# EAGLE schematic umro (EAGLE 6.5.0)
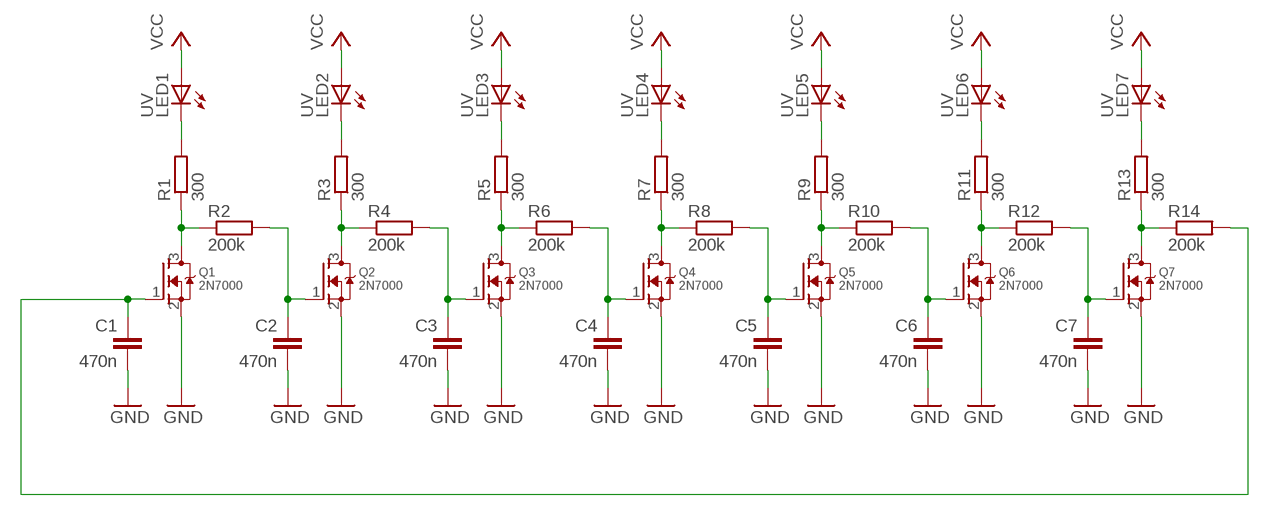
[diagram p0: schematic, sheet 1]

## Parts
C1  470n  C-EUC1206  [C1206]
C2  470n  C-EUC1206  [C1206]
C3  470n  C-EUC1206  [C1206]
C4  470n  C-EUC1206  [C1206]
C5  470n  C-EUC1206  [C1206]
C6  470n  C-EUC1206  [C1206]
C7  470n  C-EUC1206  [C1206]
LED1  UV  LED5MM  [LED5MM]
LED2  UV  LED5MM  [LED5MM]
LED3  UV  LED5MM  [LED5MM]
LED4  UV  LED5MM  [LED5MM]
LED5  UV  LED5MM  [LED5MM]
LED6  UV  LED5MM  [LED5MM]
LED7  UV  LED5MM  [LED5MM]
Q1  2N7000  MOSFET-NREFLOW  [SOT23]
Q2  2N7000  MOSFET-NREFLOW  [SOT23]
Q3  2N7000  MOSFET-NREFLOW  [SOT23]
Q4  2N7000  MOSFET-NREFLOW  [SOT23]
Q5  2N7000  MOSFET-NREFLOW  [SOT23]
Q6  2N7000  MOSFET-NREFLOW  [SOT23]
Q7  2N7000  MOSFET-NREFLOW  [SOT23]
R1  300  R-EU_M1206  [M1206]
R2  200k  R-EU_M1206  [M1206]
R3  300  R-EU_M1206  [M1206]
R4  200k  R-EU_M1206  [M1206]
R5  300  R-EU_M1206  [M1206]
R6  200k  R-EU_M1206  [M1206]
R7  300  R-EU_M1206  [M1206]
R8  200k  R-EU_M1206  [M1206]
R9  300  R-EU_M1206  [M1206]
R10  200k  R-EU_M1206  [M1206]
R11  300  R-EU_M1206  [M1206]
R12  200k  R-EU_M1206  [M1206]
R13  300  R-EU_M1206  [M1206]
R14  200k  R-EU_M1206  [M1206]

## Nets
GND: C1.2 C2.2 C3.2 C4.2 C5.2 C6.2 C7.2 Q1.2(S) Q2.2(S) Q3.2(S) Q4.2(S) Q5.2(S) Q6.2(S) Q7.2(S)
N$1: LED1.K(C) R1.2
N$2: Q1.3(D) R1.1 R2.1
N$3: C1.1 Q1.1(G) R14.2
N$4: LED2.K(C) R3.2
N$5: Q2.3(D) R3.1 R4.1
N$7: C2.1 Q2.1(G) R2.2
N$8: LED3.K(C) R5.2
N$9: Q3.3(D) R5.1 R6.1
N$10: C3.1 Q3.1(G)
N$11: LED4.K(C) R7.2
N$12: Q4.3(D) R7.1 R8.1
N$13: C4.1 Q4.1(G)
N$14: LED5.K(C) R9.2
N$15: Q5.3(D) R9.1 R10.1
N$16: C5.1 Q5.1(G)
N$17: LED6.K(C) R11.2
N$18: Q6.3(D) R11.1 R12.1
N$19: C6.1 Q6.1(G)
N$20: LED7.K(C) R13.2
N$21: Q7.3(D) R13.1 R14.1
N$22: C7.1 Q7.1(G)
VCC: LED1.A LED2.A LED3.A LED4.A LED5.A LED6.A LED7.A
Unconnected: R4.2 R6.2 R8.2 R10.2 R12.2

## Library data of the parts
C1-C7 = rcl:C-EU: CAPACITOR, European symbol
LED1-LED7 = led:LED: LED OSRAM: - CHIPLED LG R971, LG N971, LY N971, LG Q971, LY Q971, LO R971, LY R971 LH N974, LH R974 LS Q976, LO Q976, LY Q976 LO Q996 - Hyper CHIPLED LW Q18S LB Q993, LB Q99A, LB R99A - SideLED LS A670, LO A670, LY A670, LG A670, LP A670 LB A673, LV A673, LT A673, LW A673 LH A674 LY A675 LS A676, LA A676, LO A676, LY A676, LW A676 LS A679, LY A679, LG A679 - Hyper Micro SIDELED® LS Y876, LA Y876, LO Y876, LY Y876 LT Y87S - SmartLED LW L88C, LW L88S LB L89C, LB L89S, LG L890 LS L89K, LO L89K, LY L89K LS L896, LA L896, LO L896, LY L896 - TOPLED LS T670, LO T670, LY T670, LG T670, LP T670 LSG T670, LSP T670, LSY T670, LOP T670, LYG T670 LG T671, LOG T671, LSG T671 LB T673, LV T673, LT T673, LW T673 LH T674 LS T676, LA T676, LO T676, LY T676, LB T676, LH T676, LSB T676, LW T676 LB T67C, LV T67C, LT T67C, LS T67K, LO T67K, LY T67K, LW E67C LS E67B, LA E67B, LO E67B, LY E67B, LB E67C, LV E67C, LT E67C LW T67C LS T679, LY T679, LG T679 LS T770, LO T770, LY T770, LG T770, LP T770 LB T773, LV T773, LT T773, LW T773 LH T774 LS E675, LA E675, LY E675, LS T675 LS T776, LA T776, LO T776, LY T776, LB T776 LHGB T686 LT T68C, LB T68C - Hyper Mini TOPLED® LB M676 - Mini TOPLED Santana® LG M470 LS M47K, LO M47K, LY M47K Source: http://www.osram.convergy.de LUXEON: - LUMILED® LXK2-PW12-R00, LXK2-PW12-S00, LXK2-PW14-U00, LXK2-PW14-V00 LXK2-PM12-R00, LXK2-PM12-S00, LXK2-PM14-U00 LXK2-PE12-Q00, LXK2-PE12-R00, LXK2-PE12-S00, LXK2-PE14-T00, LXK2-PE14-U00 LXK2-PB12-K00, LXK2-PB12-L00, LXK2-PB12-M00, LXK2-PB14-N00, LXK2-PB14-P00, LXK2-PB14-Q00 LXK2-PR12-L00, LXK2-PR12-M00, LXK2-PR14-Q00, LXK2-PR14-R00 LXK2-PD12-Q00, LXK2-PD12-R00, LXK2-PD12-S00 LXK2-PH12-R00, LXK2-PH12-S00 LXK2-PL12-P00, LXK2-PL12-Q00, LXK2-PL12-R00 Source: www.luxeon.com KINGBRIGHT: KA-3528ASYC Source: www.kingbright.com
Q1-Q7 = adafruit:MOSFET-N: N-Channel Mosfet 2N7002E - 60V 260mA SOT23 [Digikey: 2N7002ET1GOSTR-ND] - REEL BSH103 - 30V 850mA SOT23 [Digikey: 568-5013-1-ND]
R1-R14 = rcl:R-EU_: RESISTOR, European symbol